# EAGLE schematic GAIN_SCH (EAGLE 7.6.0)

## Sheet 1 of 12
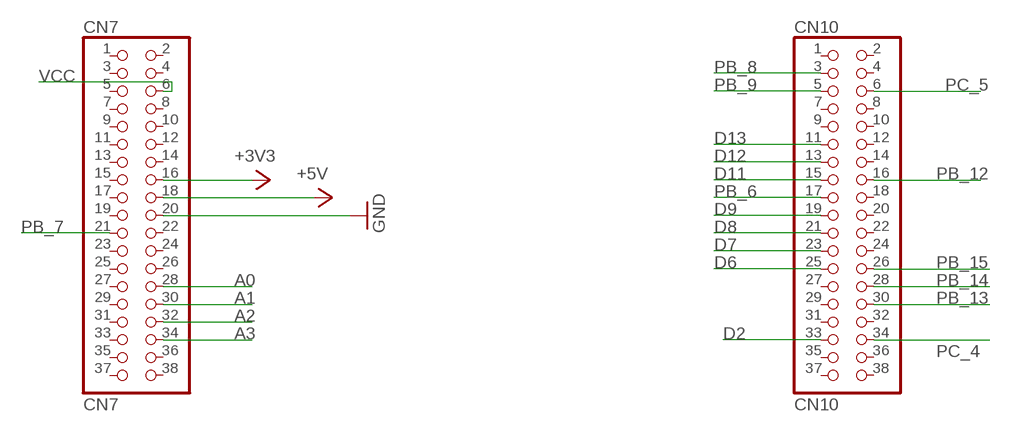
[diagram p0: schematic, sheet 1]

### Parts
CN7  CN7  PINHD-2X19  [2X19]
CN10  CN10  PINHD-2X19  [2X19]

### Nets
+3V3: CN7.16 ; also sheet 5,6,7,10,11
+5V: CN7.18 ; also sheet 2,3,4,8,9,11
A0: CN7.28 ; also sheet 2
A1: CN7.30 ; also sheet 3
A2: CN7.32 ; also sheet 4
A3: CN7.34 ; also sheet 5
D2: CN10.33 ; also sheet 8
D6: CN10.25 ; also sheet 3
D7: CN10.23 ; also sheet 2
D8: CN10.21 ; also sheet 8
D9: CN10.19 ; also sheet 6
D11: CN10.15 ; also sheet 6
D12: CN10.13 ; also sheet 6
D13: CN10.11 ; also sheet 6
GND: CN7.20 ; also sheet 2,3,4,5,6,7,8,9,10,11,12
PB_6: CN10.17 ; also sheet 10
PB_7: CN7.21 ; also sheet 10
PB_8: CN10.3 ; also sheet 9
PB_9: CN10.5 ; also sheet 9
PB_12: CN10.16 ; also sheet 7
PB_13: CN10.30 ; also sheet 7
PB_14: CN10.28 ; also sheet 7
PB_15: CN10.26 ; also sheet 7
PC_4: CN10.34 ; also sheet 11
PC_5: CN10.6 ; also sheet 11
VCC: CN7.6 ; also sheet 12
Unconnected: CN7.1 CN7.2 CN7.3 CN7.4 CN7.5 CN7.7 CN7.8 CN7.9 CN7.10 CN7.11 CN7.12 CN7.13 CN7.14 CN7.15 CN7.17 CN7.19 CN7.22 CN7.23 CN7.24 CN7.25 CN7.26 CN7.27 CN7.29 CN7.31 CN7.33 CN7.35 CN7.36 CN7.37 CN7.38 CN10.1 CN10.2 CN10.4 CN10.7 CN10.8 CN10.9 CN10.10 CN10.12 CN10.14 CN10.18 CN10.20 CN10.22 CN10.24 CN10.27 CN10.29 CN10.31 CN10.32 CN10.35 CN10.36 CN10.37 CN10.38

## Sheet 2 of 12
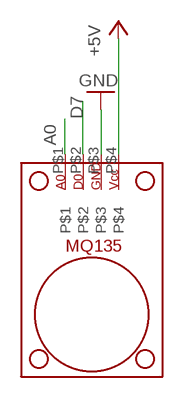
[diagram p1: schematic, sheet 2]

### Parts
U$1  MQ135  [MQ135]

### Nets
+5V: U$1.P$4 ; also sheet 1,3,4,8,9,11
A0: U$1.P$1 ; also sheet 1
D7: U$1.P$2 ; also sheet 1
GND: U$1.P$3 ; also sheet 1,3,4,5,6,7,8,9,10,11,12

## Sheet 3 of 12
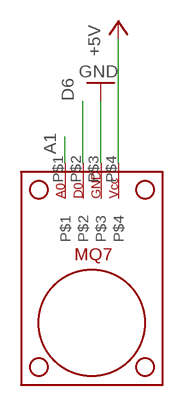
[diagram p2: schematic, sheet 3]

### Parts
U$2  MQ7  [MQ7]

### Nets
+5V: U$2.P$4 ; also sheet 1,2,4,8,9,11
A1: U$2.P$1 ; also sheet 1
D6: U$2.P$2 ; also sheet 1
GND: U$2.P$3 ; also sheet 1,2,4,5,6,7,8,9,10,11,12

## Sheet 4 of 12
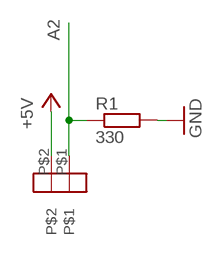
[diagram p3: schematic, sheet 4]

### Parts
R1  330  R-EU_0207/10  [0207/10]
U$3  LDR  [LDR]

### Nets
+5V: U$3.P$2 ; also sheet 1,2,3,8,9,11
A2: R1.1 U$3.P$1 ; also sheet 1
GND: R1.2 ; also sheet 1,2,3,5,6,7,8,9,10,11,12

## Sheet 5 of 12
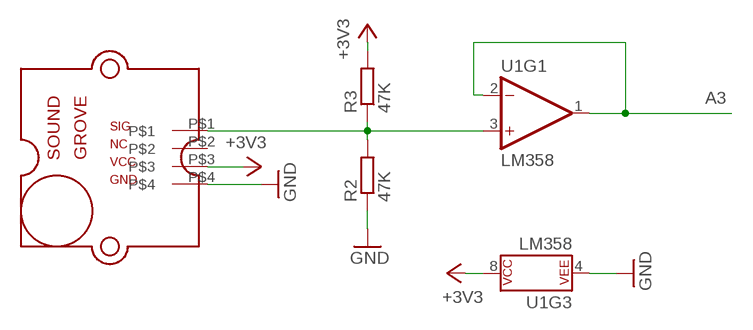
[diagram p4: schematic, sheet 5]

### Parts
R2  47K  R-EU_0207/10  [0207/10]
R3  47K  R-EU_0207/10  [0207/10]
U1  LM358  [DIP08]
U$4  GROVE_SOUND  [GROVE_SOUND]

### Nets
+3V3: R3.2 U1.8(P$V+) U$4.P$3 ; also sheet 1,6,7,10,11
A3: U1.1(OUT) U1.2(-IN) ; also sheet 1
GND: R2.1 U1.4(P$V-) U$4.P$4 ; also sheet 1,2,3,4,6,7,8,9,10,11,12
N$2: R2.2 R3.1 U1.3(+IN) U$4.P$1
Unconnected: U1.5(+IN) U1.6(-IN) U1.7(OUT) U$4.P$2

## Sheet 6 of 12
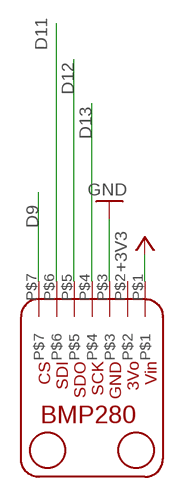
[diagram p5: schematic, sheet 6]

### Parts
U$5  BMP280  [BMP280]

### Nets
+3V3: U$5.P$1 ; also sheet 1,5,7,10,11
D9: U$5.P$7 ; also sheet 1
D11: U$5.P$6 ; also sheet 1
D12: U$5.P$5 ; also sheet 1
D13: U$5.P$4 ; also sheet 1
GND: U$5.P$3 ; also sheet 1,2,3,4,5,7,8,9,10,11,12
Unconnected: U$5.P$2

## Sheet 7 of 12
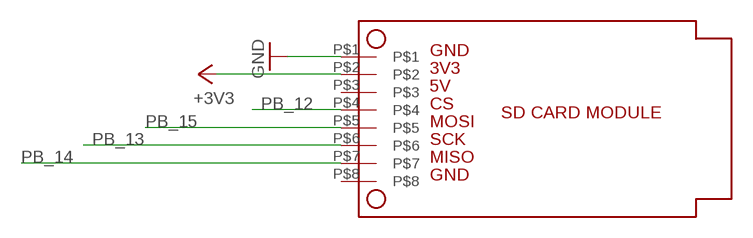
[diagram p6: schematic, sheet 7]

### Parts
U$6  SD_CARD  [SD_CARD]

### Nets
+3V3: U$6.P$2 ; also sheet 1,5,6,10,11
GND: U$6.P$1 ; also sheet 1,2,3,4,5,6,8,9,10,11,12
PB_12: U$6.P$4 ; also sheet 1
PB_13: U$6.P$6 ; also sheet 1
PB_14: U$6.P$7 ; also sheet 1
PB_15: U$6.P$5 ; also sheet 1
Unconnected: U$6.P$3 U$6.P$8

## Sheet 8 of 12
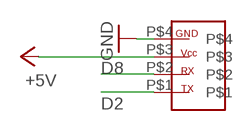
[diagram p7: schematic, sheet 8]

### Parts
U$10  CO2_GROVE  [CO2_GROVE]

### Nets
+5V: U$10.P$3 ; also sheet 1,2,3,4,9,11
D2: U$10.P$1 ; also sheet 1
D8: U$10.P$2 ; also sheet 1
GND: U$10.P$4 ; also sheet 1,2,3,4,5,6,7,9,10,11,12

## Sheet 9 of 12
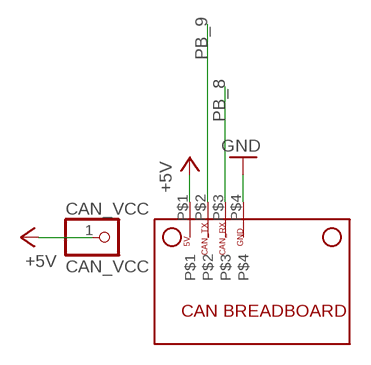
[diagram p8: schematic, sheet 9]

### Parts
CAN_VCC  CAN_VCC  PINHD-1X1  [1X01]
U$7  CAN_BREADBOARD  [CAN_BREAKBOARD]

### Nets
+5V: CAN_VCC.1 U$7.P$1 ; also sheet 1,2,3,4,8,11
GND: U$7.P$4 ; also sheet 1,2,3,4,5,6,7,8,10,11,12
PB_8: U$7.P$3 ; also sheet 1
PB_9: U$7.P$2 ; also sheet 1

## Sheet 10 of 12
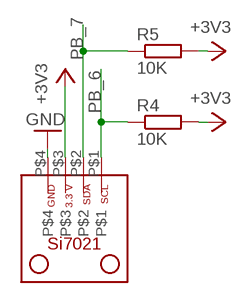
[diagram p9: schematic, sheet 10]

### Parts
R4  10K  R-EU_0207/10  [0207/10]
R5  10K  R-EU_0207/10  [0207/10]
U$8  SI7021  [SI7021]

### Nets
+3V3: R4.2 R5.2 U$8.P$3 ; also sheet 1,5,6,7,11
GND: U$8.P$4 ; also sheet 1,2,3,4,5,6,7,8,9,11,12
PB_6: R4.1 U$8.P$1 ; also sheet 1
PB_7: R5.1 U$8.P$2 ; also sheet 1

## Sheet 11 of 12
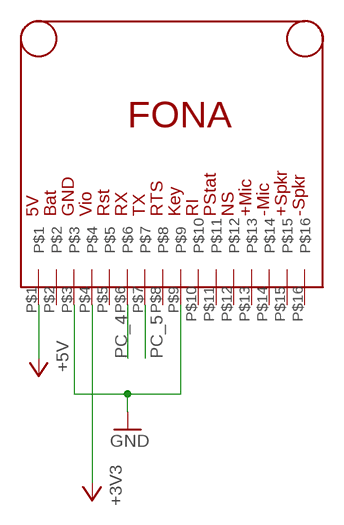
[diagram p10: schematic, sheet 11]

### Parts
U$9  FONA  [FONA]

### Nets
+3V3: U$9.P$4 ; also sheet 1,5,6,7,10
+5V: U$9.P$1 ; also sheet 1,2,3,4,8,9
GND: U$9.P$3 U$9.P$9 ; also sheet 1,2,3,4,5,6,7,8,9,10,12
PC_4: U$9.P$6 ; also sheet 1
PC_5: U$9.P$7 ; also sheet 1
Unconnected: U$9.P$2 U$9.P$5 U$9.P$8 U$9.P$10 U$9.P$11 U$9.P$12 U$9.P$13 U$9.P$14 U$9.P$15 U$9.P$16

## Sheet 12 of 12
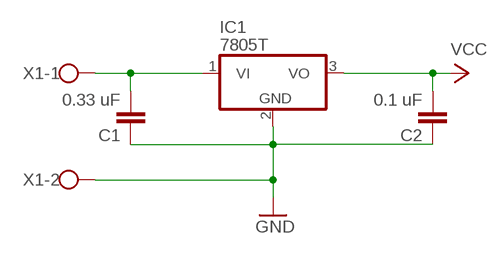
[diagram p11: schematic, sheet 12]

### Parts
C1  0.33 uF  C-EU050-030X075  [C050-030X075]
C2  0.1 uF  C-EU050-030X075  [C050-030X075]
IC1  7805T  [TO220H]
X1  W237-102  [W237-102]

### Nets
GND: C1.1 C2.1 IC1.2(GND) X1.2 ; also sheet 1,2,3,4,5,6,7,8,9,10,11
N$3: C1.2 IC1.1(VI) X1.1
VCC: C2.2 IC1.3(VO) ; also sheet 1

## Library data of the parts
C1 C2 = resistor:C-EU: CAPACITOR, European symbol
CAN_VCC = pinhead:PINHD-1X1: PIN HEADER
CN7 CN10 = pinhead:PINHD-2X19: PIN HEADER
IC1 = linear:78*: Positive VOLTAGE REGULATOR Source: http://cache.national.com/ds/LM/LM78L05.pdf http://www.fairchildsemi.com/ds/LM/LM7805.pdf
R1-R5 = resistor:R-EU_: RESISTOR, European symbol
U1 = SparkFun-IC-Amplifiers:LM358: LM358 Jellybean op-amp Datasheet <http://www.sparkfun.com/datasheets/Components/General/LM358.pdf> SparkFun Products Op-Amp (Thru-Hole) - LM358 <https://www.sparkfun.com/products/9456> (COM-09456); PROD_ID: IC-09172
U$1 = MQ135:MQ135
U$2 = MQ7:MQ7
U$3 = LDR:LDR
U$4 = GROVE_SOUND:GROVE_SOUND
U$5 = BMP280:BMP280
U$6 = SD_CARD:SD_CARD
U$7 = CAN_BREADBOARD:CAN_BREADBOARD
U$8 = Si7021:SI7021
U$9 = FONA:FONA
U$10 = CO2_GROVE:CO2_GROVE
X1 = con-wago-500:W237-102: WAGO SCREW CLAMP; MPN: 237-102; OC_FARNELL: unknown; OC_NEWARK: 70K9898